# Altium schematic sheet wisp-6-peripherals.SchDoc: Peripherals
size B; SheetNumber: 4; SheetTotal: 4
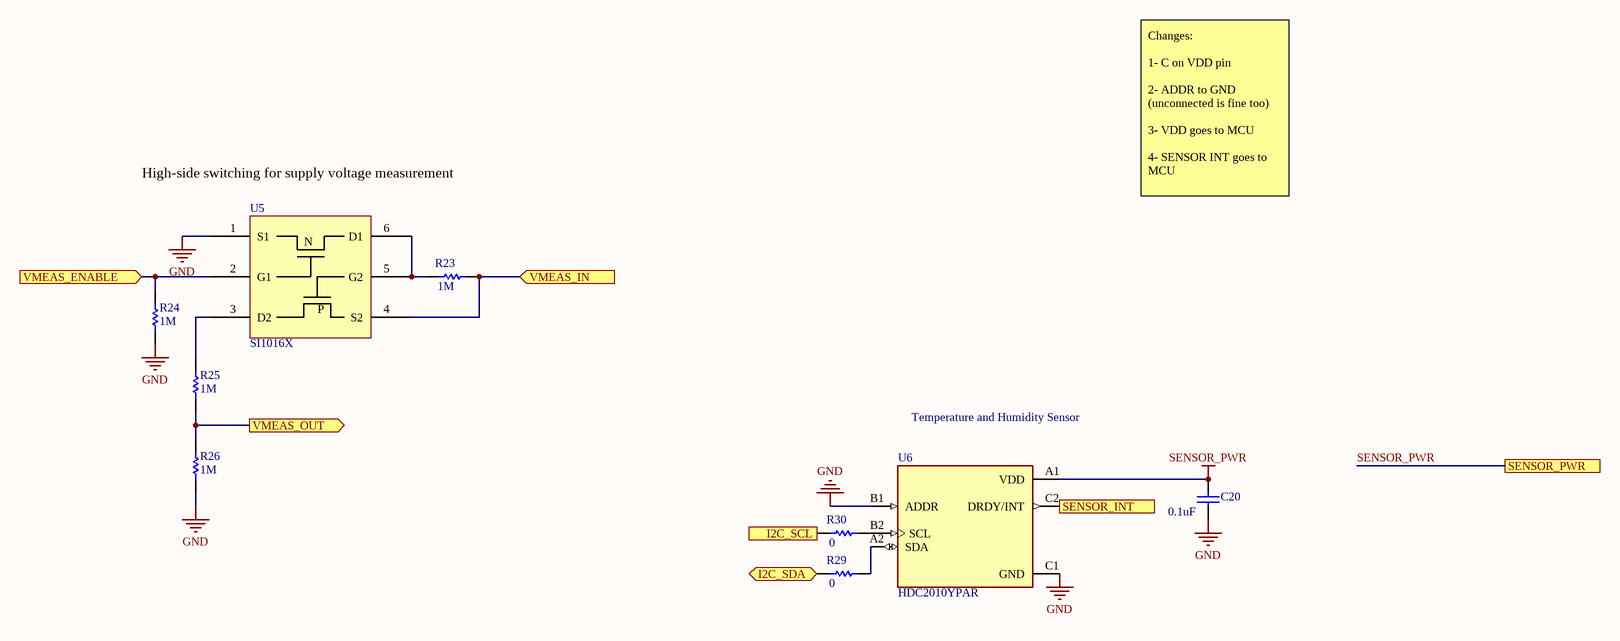
[diagram p0: wisp-6-peripherals.SchDoc]

## Parts
C20  value 0.1uF  [0402]  (hidden comment: Cap)
R23  value 1M  [0402]  (hidden comment: Res)
R24  value 1M  [0402]  (hidden comment: Res)
R25  value 1M  [0402]  (hidden comment: Res)
R26  value 1M  [0402]  (hidden comment: Res)
R29  value 0  [0402]  (hidden comment: Res)
R30  value 0  [0402]  (hidden comment: Res)
U5  SI1016X  [SC-89-6 Vishay]
U6  HDC2010YPAR  [BGA6C100X50P2X3_HDC2010YPAR]

## Ports
I2C_SCL (in), I2C_SDA (bidir), SENSOR_INT (out), SENSOR_PWR, VMEAS_ENABLE (in), VMEAS_IN (in), VMEAS_OUT (out)

## Nets
GND: C20.1 R24.1 R26.1 U5.1(S1) U6.B1(ADDR) U6.C1(GND)
SENSOR_PWR: C20.2 U6.A1(VDD) ; port SENSOR_PWR
I2C_SCL: R30.2 ; port I2C_SCL
I2C_SDA: R29.2 ; port I2C_SDA
SENSOR_INT: U6.C2(DRDY/INT) ; port SENSOR_INT
VMEAS_ENABLE: R24.2 U5.2(G1) ; port VMEAS_ENABLE
VMEAS_IN: R23.1 U5.4(S2) ; port VMEAS_IN
VMEAS_OUT: R25.1 R26.2 ; port VMEAS_OUT
NetR23_2: R23.2 U5.5(G2) U5.6(D1)
NetR25_2: R25.2 U5.3(D2)
NetR29_1: R29.1 U6.A2(SDA)
NetR30_1: R30.1 U6.B2(SCL)

## Notes on the sheet
- High-side switching for supply voltage measurement
- Changes:
  1- C on VDD pin
  2- ADDR to GND (unconnected is fine too)
  3- VDD goes to MCU
  4- SENSOR INT goes to MCU
- Temperature and Humidity Sensor
- (in symbol SI1016X) N; P

## Library data of the parts
C20 = Cap: Ceramic Capacitor (Surface Mount); Manufacturer: Generic Ceramic Chip Cap (TBD); Digi-Key Part Number: *; Manufacturer Part Number: *; Note: *; Rating: *
R23-R26 R29 R30 = Res: Chip Resistor (Surface Mount); Manufacturer: Generic Chip Res (TBD); Manufacturer Part Number: *; Digi-Key Part Number: *; Rating: *
U5 = SI1016X: NMOS and PMOS array
U6 = HDC2010YPAR: Humidity Temperature Sensor 0 ~ 100% RH IÂ²C Â±2% 8s Surface Mount; MF: Texas Instruments; MP: HDC2010YPAR; SnapEDA_Link: https://www.snapeda.com/parts/HDC2010YPAR/Texas%20Instruments/view-part/1603012/?ref=snap; Digi-Key_Purchase_URL: https://www.digikey.in/product-detail/en/texas-instruments/HDC2010YPAR/296-47774-1-ND/8133123?utm_source=snapeda&utm_medium=aggregator&utm_campaign=symbol; Package: DSBGA-6 Texas Instruments; Value: *; Digi-Key_Part_Number: 296-47774-1-ND